# Altium schematic sheet USB.SchDoc
size B
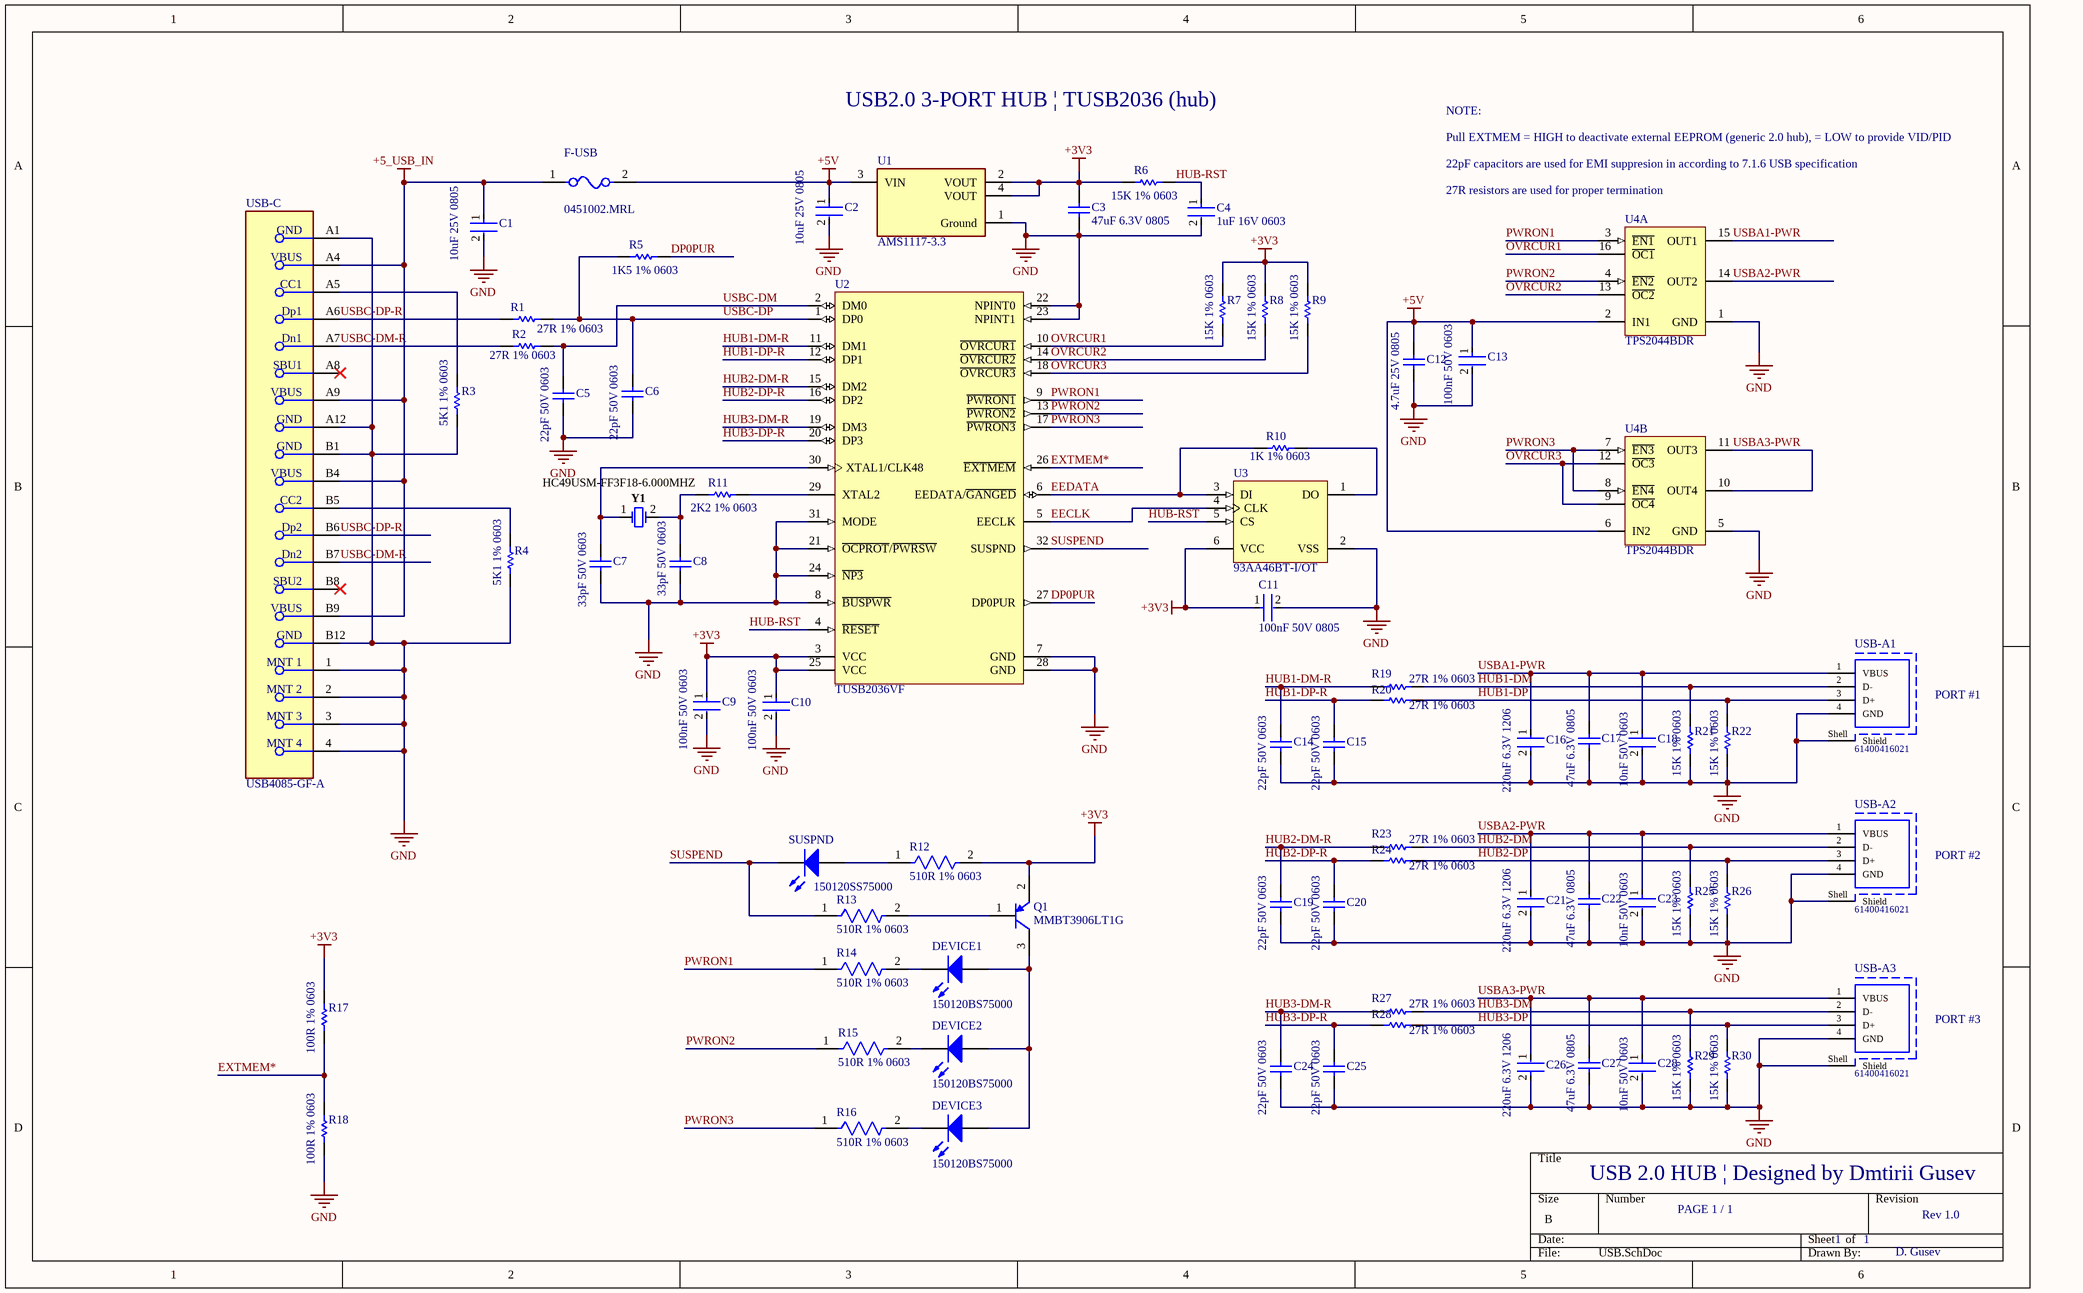
[diagram p0: USB.SchDoc]

## Parts
C1  10uF 25V 0805  [FP-GRM21B-0_15-IPC_C]
C2  10uF 25V 0805  [FP-GRM21B-0_15-IPC_C]
C3  47uF 6.3V 0805  [CAPC2013X145X50LL20T25]
C4  1uF 16V 0603  [FP-CC0603-DA-MFG]
C5  22pF 50V 0603  [CAPC1608X90X35ML10T15]
C6  22pF 50V 0603  [CAPC1608X90X35ML10T15]
C7  33pF 50V 0603  [CAPC1608X90X40LL10T20]
C8  33pF 50V 0603  [CAPC1608X90X40LL10T20]
C9  100nF 50V 0603  [FP-CGA3E-0_3-0_1-IPC_A]
C10  100nF 50V 0603  [FP-CGA3E-0_3-0_1-IPC_A]
C11  100nF 50V 0805  [FP-C0805C-DN-MFG]
C12  4.7uF 25V 0805  [CAPC2013X135X45ML10T25]
C13  100nF 50V 0603  [FP-CGA3E-0_3-0_1-IPC_A]
C14  22pF 50V 0603  [CAPC1608X90X35ML10T15]
C15  22pF 50V 0603  [CAPC1608X90X35ML10T15]
C16  220uF 6.3V 1206  [FP-GRM31C-0_3-e0_3_0_9-IPC_C]
C17  47uF 6.3V 0805  [CAPC2013X145X50LL20T25]
C18  10nF 50V 0603  [FP-CC0603-DA-MFG]
C19  22pF 50V 0603  [CAPC1608X90X35ML10T15]
C20  22pF 50V 0603  [CAPC1608X90X35ML10T15]
C21  220uF 6.3V 1206  [FP-GRM31C-0_3-e0_3_0_9-IPC_C]
C22  47uF 6.3V 0805  [CAPC2013X145X50LL20T25]
C23  10nF 50V 0603  [FP-CC0603-DA-MFG]
C24  22pF 50V 0603  [CAPC1608X90X35ML10T15]
C25  22pF 50V 0603  [CAPC1608X90X35ML10T15]
C26  220uF 6.3V 1206  [FP-GRM31C-0_3-e0_3_0_9-IPC_C]
C27  47uF 6.3V 0805  [CAPC2013X145X50LL20T25]
C28  10nF 50V 0603  [FP-CC0603-DA-MFG]
DEVICE1  150120BS75000  [1206_A]
DEVICE2  150120BS75000  [1206_A]
DEVICE3  150120BS75000  [1206_A]
F-USB  0451002.MRL  [FP-0451-MFG]
Q1  MMBT3906LT1G  [ONSC-SOT-23-3-318-08_V]
R1  27R 1% 0603  [RESC1608X55X30NL15T15]
R2  27R 1% 0603  [RESC1608X55X30NL15T15]
R3  5K1 1% 0603  [RESC1608X55X25ML10T15]
R4  5K1 1% 0603  [RESC1608X55X25ML10T15]
R5  1K5 1% 0603  [RESC1608X55X25ML10T15]
R6  15K 1% 0603  [RESC1608X55X25ML10T15]
R7  15K 1% 0603  [RESC1608X55X25ML10T15]
R8  15K 1% 0603  [RESC1608X55X25ML10T15]
R9  15K 1% 0603  [RESC1608X55X25ML10T15]
R10  1K 1% 0603  [RESC1608X55X25NL10T15]
R11  2K2 1% 0603  [RESC1608X55X25LL10T15]
R12  510R 1% 0603  [FP-AC0603-MFG]
R13  510R 1% 0603  [FP-AC0603-MFG]
R14  510R 1% 0603  [FP-AC0603-MFG]
R15  510R 1% 0603  [FP-AC0603-MFG]
R16  510R 1% 0603  [FP-AC0603-MFG]
R17  100R 1% 0603  [RESC1608X55X25ML10T15]
R18  100R 1% 0603  [RESC1608X55X25ML10T15]
R19  27R 1% 0603  [RESC1608X55X30NL15T15]
R20  27R 1% 0603  [RESC1608X55X30NL15T15]
R21  15K 1% 0603  [RESC1608X55X25ML10T15]
R22  15K 1% 0603  [RESC1608X55X25ML10T15]
R23  27R 1% 0603  [RESC1608X55X30NL15T15]
R24  27R 1% 0603  [RESC1608X55X30NL15T15]
R25  15K 1% 0603  [RESC1608X55X25ML10T15]
R26  15K 1% 0603  [RESC1608X55X25ML10T15]
R27  27R 1% 0603  [RESC1608X55X30NL15T15]
R28  27R 1% 0603  [RESC1608X55X30NL15T15]
R29  15K 1% 0603  [RESC1608X55X25ML10T15]
R30  15K 1% 0603  [RESC1608X55X25ML10T15]
SUSPND  150120SS75000  [1206_A]
U1  AMS1117-3.3  [FP-AMS1117-IPC_C]
U2  TUSB2036VF  [VF0032A_N]
U3  93AA46BT-I/OT  [SOT-23-OT6_N]
U4  TPS2044BDR  [D0016A_M]  (parts A,B of 2)
USB-A1  61400416021  [61400416021]
USB-A2  61400416021  [61400416021]
USB-A3  61400416021  [61400416021]
USB-C  USB4085-GF-A  [FP-USB4085-GF-A-MFG]
Y1  HC49USM-FF3F18-6.000MHZ  [ABRA-ABLS-14.7456MHZ-B2-T_V]

## Nets
+3V3: C3.2 C9.1 C10.1 C11.1 Q1.2(E) R6.1 R7.2 R8.2 R9.2 R12.2 R17.2 U1.2(VOUT) U1.4(VOUT) U2.3(VCC) U2.25(VCC) U3.6(VCC)
+5_USB_IN: C1.1 F-USB.1 USB-C.A4(VBUS) USB-C.A9(VBUS) USB-C.B4(VBUS) USB-C.B9(VBUS)
+5V: C2.1 C12.2 C13.1 F-USB.2 U1.3(VIN) U4.2(IN1) U4.6(IN2)
GND: C1.2 C2.2 C3.1 C4.2 C5.1 C6.1 C7.1 C8.1 C9.2 C10.2 C11.2 C12.1 C13.2 C14.1 C15.1 C16.2 C17.1 C18.2 C19.1 C20.1 C21.2 C22.1 C23.2 C24.1 C25.1 C26.2 C27.1 C28.2 R3.1 R4.1 R18.1 R21.1 R22.1 R25.1 R26.1 R29.1 R30.1 U1.1(Ground) U2.7(GND) U2.8(~{BUSPWR}) U2.21(~{OCPROT}/~{PWRSW}) U2.22(NPINT0) U2.23(NPINT1) U2.24(~{NP3}) U2.28(GND) U2.31(MODE) U3.2(VSS) U4.1(GND) U4.5(GND) USB-A1.4(GND) USB-A1.Shell(Shield) USB-A2.4(GND) USB-A2.Shell(Shield) USB-A3.4(GND) USB-A3.Shell(Shield) USB-C.1(MNT_1) USB-C.2(MNT_2) USB-C.3(MNT_3) USB-C.4(MNT_4) USB-C.A1(GND) USB-C.A12(GND) USB-C.B1(GND) USB-C.B12(GND)
DP0PUR: R5.2 U2.27(DP0PUR)
EECLK: U2.5(EECLK) U3.4(CLK)
EEDATA: R10.1 U2.6(EEDATA/~{GANGED}) U3.3(DI)
EXTMEM*: R17.1 R18.2 U2.26(~{EXTMEM})
HUB1-DM: R19.2 R21.2 USB-A1.2(D-)
HUB1-DM-R: C14.2 R19.1 U2.11(DM1)
HUB1-DP: R20.2 R22.2 USB-A1.3(D+)
HUB1-DP-R: C15.2 R20.1 U2.12(DP1)
HUB2-DM: R23.2 R25.2 USB-A2.2(D-)
HUB2-DM-R: C19.2 R23.1 U2.15(DM2)
HUB2-DP: R24.2 R26.2 USB-A2.3(D+)
HUB2-DP-R: C20.2 R24.1 U2.16(DP2)
HUB3-DM: R27.2 R29.2 USB-A3.2(D-)
HUB3-DM-R: C24.2 R27.1 U2.19(DM3)
HUB3-DP: R28.2 R30.2 USB-A3.3(D+)
HUB3-DP-R: C25.2 R28.1 U2.20(DP3)
HUB-RST: C4.1 R6.2 U2.4(~{RESET}) U3.5(CS)
OVRCUR1: R7.1 U2.10(~{OVRCUR1}) U4.16(~{OC1})
OVRCUR2: R8.1 U2.14(~{OVRCUR2}) U4.13(~{OC2})
OVRCUR3: R9.1 U2.18(~{OVRCUR3}) U4.9(~{OC4}) U4.12(~{OC3})
PWRON1: R14.1 U2.9(~{PWRON1}) U4.3(~{EN1})
PWRON2: R15.1 U2.13(~{PWRON2}) U4.4(~{EN2})
PWRON3: R16.1 U2.17(~{PWRON3}) U4.7(~{EN3}) U4.8(~{EN4})
SUSPEND: R13.1 SUSPND.1(K) U2.32(SUSPND)
USBA1-PWR: C16.1 C17.2 C18.1 U4.15(OUT1) USB-A1.1(VBUS)
USBA2-PWR: C21.1 C22.2 C23.1 U4.14(OUT2) USB-A2.1(VBUS)
USBA3-PWR: C26.1 C27.2 C28.1 U4.10(OUT4) U4.11(OUT3) USB-A3.1(VBUS)
USBC-DM: C5.2 R2.2 U2.2(DM0)
USBC-DM-R: R2.1 USB-C.A7(Dn1) USB-C.B7(Dn2)
USBC-DP: C6.2 R1.2 R5.1 U2.1(DP0)
USBC-DP-R: R1.1 USB-C.A6(Dp1) USB-C.B6(Dp2)
NetC7_2: C7.2 U2.30(XTAL1/CLK48) Y1.1
NetC8_2: C8.2 R11.1 Y1.2
NetDEVICE1_1: DEVICE1.1(K) R14.2
NetDEVICE1_2: DEVICE1.2(A) DEVICE2.2(A) DEVICE3.2(A) Q1.3(C)
NetDEVICE2_1: DEVICE2.1(K) R15.2
NetDEVICE3_1: DEVICE3.1(K) R16.2
NetQ1_1: Q1.1(B) R13.2
NetR3_2: R3.2 USB-C.A5(CC1)
NetR4_2: R4.2 USB-C.B5(CC2)
NetR10_2: R10.2 U3.1(DO)
NetR11_2: R11.2 U2.29(XTAL2)
NetR12_1: R12.1 SUSPND.2(A)

Not connected (* = marked no-connect by the designer): USB-C A8(SBU1)* B8(SBU2)*

## Notes on the sheet
- USB2.0 3-PORT HUB | TUSB2036 (hub)
- NOTE:
- Pull EXTMEM = HIGH to deactivate external EEPROM (generic 2.0 hub), = LOW to provide VID/PID
- 22pF capacitors are used for EMI suppresion in according to 7.1.6 USB specification
- (near U4) 27R resistors are used for proper termination
- PORT #1
- PORT #2
- PORT #3
- USB 2.0 HUB | Designed by Dmtirii Gusev
- PAGE 1 / 1
- 1
- Rev 1.0
- D. Gusev

## Library data of the parts
C1 C2 = CMP-2007-03541-2: Chip Multilayer Ceramic Capacitors for General Purpose, 0805, 10uF, X5R, 15%, 10%, 25V; Length: 2mm; Depth: 1.25mm; Termination: SMD/SMT; Voltage: 25V; Height: 1.25mm; Material: Ceramic; Thickness: 0.053inch; Radiation Hardening: No; Min Operating Temperature: -55°C; Width: 0.049inch; Package Quantity: 1; Mount: Surface Mount; Dielectric: X5R; Packaging: Tape and Reel; Capacitance: 10uF; Voltage Rating (DC): 25V; Lead Free: Lead Free; Max Operating Temperature: 85°C; Case Code (Imperial): 0805; Case/Package: 0805; Tolerance: 10%; Voltage Rating: 25V; Case Code (Metric): 2012
C3 C17 C22 C27 = CMP-2007-01008-1: Manufacturer: Kemet; Part Number: C0805C476M9PACTU
C4 = CMP-03422-000924-1: CAP CER 1UF 16V X7R 0603; Manufacturer: YAGEO; Manufacturer Part Number: CC0603KRX7R7BB105; Tolerance: 0.1; Temperature Coefficient: 15%; Material: Ceramic; Package: CC0603-DA; RoHS: TRUE; Device Class L2: Capacitors; Temperature Characteristic: X7R; Temperature: -55°C to +125°C; Temperature Range Low: -55°C; Automotive: No; ComponentLink2Description: Datasheet; Value: 1 uF; Lead Free: Yes; Capacitance: 1 uF; ComponentLink2URL: http://www.yageo.com/documents/recent/UPY-GPHC_X7R_6.3V-to-50V_18.pdf; Device Class L1: Passive Components; Voltage: 16 V; Octopart: https://octopart.com/cc0603krx7r7bb105-yageo-42271928; Category: Cap; Digikey Description: CAP CER 1UF 16V X7R 0603; Footprint Url: http://www.yageo.com/exep/pages/download/literatures/UPY-C_GEN_24.pdf; Height: 0.9mm; Voltage Rating: 16 V; Temperature Range High: +125°C; Mouser Description: Multilayer Ceramic Capacitor, CC Series, 1 - F, - 10%, X7R, 16 V, 0603 [1608 Metric]; Device Class L3: Ceramic Capacitors
C5 C6 C14 C15 C19 C20 C24 C25 = CMP-2000-04945-1: Chip Capacitor, 22 pF, +/- 5%, 50 V, -55 to 125 degC, 0603 (1608 Metric), RoHS, Tape and Reel; Manufacturer: Murata; Dielectric: C0G; Capacitance: 22pF; Manufacturer URL: http://www.murata.com/; Datasheet Version: Jul-06; Package Reference: 603; Tolerance (%): ±5%; Case Size/Dimension: 0603; Rated Voltage: 50V; Package Description: 2-Pin Surface Mount Device, Body 1.6 x 0.8 mm; Datasheet URL: https://datasheet.ciiva.com/11786/0900766b807a1cab-11786398.pdf
C7 C8 = CMP-2000-06072-1: Chip Capacitor, 33 pF, +/- 5%, 50 V, -55 to 125 degC, 0603 (1608 Metric), RoHS, Tape and Reel; Manufacturer: Yageo; Product Training Modules: MultilayerCeramicCapacitors; Featured Product: CommodityMultilayerCeramicCapacitors–CCSeries; Other Names: 0603CG330J9B200223886715339223886715339311-1064-2311-1282-2311-1282-2-NDCC0603JRNP09BN330BCC0603JRNPO9BN330B; Online Catalog: CCSeries; Temperature Coefficient: C0G,NP0; Operating Temperature: -55°C~125°C; Thickness (Max): 0.035"(0.90mm); Size / Dimension: 0.063"Lx0.031"W(1.60mmx0.80mm); Lead Spacing: -; Mounting Type: SurfaceMount,MLCC; Voltage - Rated: 50V; Tolerance: ±5%; Standard Package: 4,000; Mounting Technology: SurfaceMount; Ratings: -; Capacitance: 33pF; Applications: GeneralPurpose; Height - Seated (Max): -; Packaging: Tape&Reel(TR); Series: CC; Package / Case: 0603(1608Metric); Package Description: 2-Pin Surface Mount Device, Body 1.6 x 0.8 mm; Manufacturer URL: http://www.yageo.com/; Family: CeramicCapacitors; Package Reference: 0603; Category: Capacitors; Datasheet Version: Rev. 14, 07/2016; Datasheet URL: http://www.yageo.com/NewPortal/yageodocoutput?fileName=/pdf/MLCC/UPY-GP_NP0_16V-to-50V_14.pdf; Features: -; Lead Style: -
C9 C10 C13 = CMP-2000-07546-2: Cap Ceramic 100nF 50V X7R 10% Pad SMD 0603 +125°C Automotive T/R; Weight: 7.1E-05oz; Composition: Ceramic; Max Operating Temperature: 125°C; Termination: SMD/SMT; Dielectric: X7R; Length: 1.6mm; Package Quantity: 1; REACH SVHC: No SVHC; Lead Free: Lead Free; Case Code (Metric): 1608; Min Operating Temperature: -55°C; Packaging: Tape and Reel; Tolerance: 10%; Voltage Rating: 50V; Case Code (Imperial): 0603; Capacitance: 100nF; Case/Package: 0603; Voltage Rating (DC): 50V; Depth: 0.8mm; Radiation Hardening: No; Ratings: AEC-Q200; Mount: Surface Mount; Voltage: 50V; Thickness: 0.035inch; Width: 0.8mm; Height: 0.8mm
C11 = CMP-2007-00279-2: CAP CER 0.1UF 50V X7R 0805; Manufacturer Part Number: C0805C104K5RACTU; Manufacturer: KEMET; Value: 0.10 μF; Tolerance: 0.1; Temperature Coefficient: 30ppm/°C; Material: Ceramic; Device Class L2: Capacitors; Temperature Range Low: -55°C; Voltage Rating: 50 V; Digikey Description: CAP CER 0.1UF 50V X7R 0805; Category: Cap; ComponentLink2Description: Datasheet; Octopart: https://octopart.com/c0805c104k5ractu-kemet-143926; RoHS: TRUE; ComponentLink2URL: https://content.kemet.com/datasheets/KEM_C1003_C0G_SMD.pdf; Temperature Characteristic: X7R; Temperature: -55°C to +125°C; Height: 0.88mm; Temperature Range High: +125°C; Device Class L1: Passive Components; Automotive: No; Lead Free: Yes; Ipc Land Pattern Name: CAPC200125X78; Device Class L3: Ceramic Capacitors; Mouser Description: Cap Ceramic 0.1uF 50V X7R 10% SMD 2.0 x 1.2 mm 125 C Paper T/R; Capacitance: 0.10 μF; Package: C0805C-DN
C12 = CMP-2007-03546-1: Manufacturer: Murata; Part Number: GRM21BR61E475MA12L
C16 C21 C26 = CMP-06035-000079-2: Chip Multilayer Ceramic Capacitors for General Purpose, 1206, 220uF, X5R, 15%, 20%, 6.3V; Mount: Surface Mount; Width: 0.063inch; Voltage Rating: 6.3V; Packaging: Cut Tape; Dielectric: X5R; Capacitance: 220uF; Voltage Rating (DC): 6.3V; Case/Package: 1206; Thickness: 0.075inch; Tolerance: 20%; Max Operating Temperature: 85°C; Case Code (Metric): 3216; Min Operating Temperature: -55°C; Length: 0.126inch; REACH SVHC: No SVHC; Case Code (Imperial): 1206
C18 C23 C28 = CMP-2100-03600-2: CAP CER 10000PF 50V X7R 0603; Manufacturer Part Number: CC0603KRX7R9BB103; Manufacturer: YAGEO; Tolerance: 0.1; Material: Ceramic; Temperature Coefficient: 15%; Mouser Description: Multilayer Ceramic Capacitor, CC Series, 0.01 - F, - 10%, X7R, 50 V, 0603 [1608 Metric]; Digikey Description: CAP CER 10000PF 50V X7R 0603; Height: 0.9mm; Category: Cap; Temperature Characteristic: X7R; Footprint Url: http://www.yageo.com/exep/pages/download/literatures/UPY-C_GEN_24.pdf; Lead Free: Yes; Voltage Rating: 50 V; Temperature: -55°C to +125°C; Device Class L3: Ceramic Capacitors; ComponentLink2Description: Datasheet; Voltage: 50 V; Package: CC0603-DA; Octopart: https://octopart.com/cc0603krx7r9bb103-yageo-192938; Automotive: No; Temperature Range High: +125°C; Temperature Range Low: -55°C; Value: 10 nF; RoHS: TRUE; Device Class L1: Passive Components; ComponentLink2URL: http://www.yageo.com/documents/recent/UPY-GPHC_X7R_6.3V-to-50V_18.pdf; Device Class L2: Capacitors; Capacitance: 10 nF
DEVICE1-DEVICE3 = CMP-1426-00015-1: SMD mono-color Chip LED, WL-SMCW, Blue; Manufacturer: Wuerth Elektronik; ComponentLink2Description: Datasheet; ComponentLink1URL: http://www.we-online.com; PartNumber: 150120BS75000; ComponentLink1Description: Manufacturer URL; ComponentLink2URL: http://katalog.we-online.com/led/datasheet/150120BS75000.pdf; PackageReference: 1206_A; Color: Blue
F-USB = CMP-08605-000053-1: FUSE BOARD MNT 2A 125VAC/VDC SMD; Manufacturer: Littelfuse; Max Fuse Dc Voltage: 125V; Value: 0.0367Ω; Fuse Interrupt Ac Current: 50A; Fuse I2T: 0.53A2Sec; Fuse Blow Speed: Fast; Device Class L2: Fuses; Temperature Range High: +125°C; Category: Fuse; ComponentLink2URL: https://www.littelfuse.com/~/media/electronics/datasheets/fuses/littelfuse_fuse_451_453_datasheet.pdf.pdf; Automotive: No; Temperature Range Low: -55°C; Voltage Rating: 125V; ComponentLink2Description: Datasheet; Temperature: -55°C to +125°C; Device Class L3: unset; Height: 2.94mm; Lead Free: Yes; Resistance: 0.0367Ω; Max Fuse Ac Voltage: 125V; Fuse Interrupt Dc Current: 50A; RoHS: TRUE; Fuse Current: 2A; Digikey Description: FUSE BOARD MNT 2A 125VAC/VDC SMD; Device Class L1: Circuit Protection; Octopart: https://octopart.com/0451002.mrl-littelfuse-566376; Mouser Description: Surface Mount Fuses 125V 2A; Package: 0451; Manufacturer Part Number: 0451002.MRL
Q1 = CMP-1048-00670-1: General Purpose Transistor, PNP Silicon, 3-Pin SOT-23, Pb-Free, Tape and Reel; Manufacturer: On Semiconductor; IC Continuous (A): -0.2; fT Min (MHz): 250; PackageDescription: 3-Pin Small Outline Transistor, Body 2.92 x 1.3 mm, Pitch 0.95 mm; PartNumber: MMBT3906LT1G; Packing: Tape and Reel; ComponentLink3Description: Package Specification; Mounting Technology: Surface Mount; ComponentLink3URL: http://www.onsemi.cn/pub_link/Collateral/318-08.PDF; ComponentLink1URL: http://www.onsemi.com/; ComponentLink2URL: http://www.onsemi.cn/pub_link/Collateral/MMBT3906LT1-D.PDF; PackageReference: SOT-23-3-318-08; Polarity: PNP; ComponentLink2Description: Datasheet; PackageVersion: Rev. AP, 11/2009; RoHS: TRUE; DatasheetVersion: Rev. 11; ComponentLink1Description: Manufacturer URL
R1 R2 R19 R20 R23 R24 R27 R28 = CMP-2000-00396-1: Manufacturer: Panasonic; Part Number: ERJ3EKF27R0V
R3 R4 = CMP-2000-04091-1: Manufacturer: Yageo; Part Number: RC0603FR-075K1L
R5 = CMP-2100-03665-1: Chip Resistor, 1.5 KOhm, +/- 1%, 0.1 W, -55 to 155 degC, 0603 (1608 Metric), RoHS, Tape and Reel; Manufacturer: Yageo; Power Rating: 100mW; Voltage Rating: 50V; Temperature Coefficient: 100ppm/degreesC; Military Standard: Not; Datasheet URL: http://www.yageo.com/NewPortal/yageodocoutput?fileName=/pdf/R-Chip/PYu-RC_Group_51_RoHS_L_5.pdf; Package Description: 2-Pin Surface Mount Device, Body 1.6 x 0.8 mm; Composition: ThickFilm; Case Code (Metric): 1608; Case/Package: 0603; Number of Terminations: 2; Depth: 0.8mm; Height: 0.022inch; Manufacturer URL: http://www.yageo.com/; Lead Free: LeadFree; Min Operating Temperature: -55degC; Max Operating Temperature: 155degC; Datasheet Version: Rev. 5, 10/2016; RoHSCompliant: true; Max Power Dissipation: 100mW; Packaging: TapeandReel; Voltage Rating (DC): 50V; Length: 0.063inch; Tolerance: 1%; Width: 0.031inch; Number of Pins: 2; Termination: SMD/SMT; Package Reference: 0603; Package Quantity: 1; Case Code (Imperial): 0603; Resistance: 1.5KOhm; REACH SVHC: NoSVHC
R6-R9 R21 R22 R25 R26 R29 R30 = CMP-1659-00032-1: Chip Resistor, 15 KOhm, +/- 1%, 0.1 W, -55 to 155 degC, 0603 (1608 Metric), RoHS, Tape and Reel; PackageDescription: 2-Pin Surface Mount Device, Body 1.6 x 0.8 mm; RoHSCompliant: true; ComponentLink2Description: Datasheet; DatasheetVersion: Rev. 4, 02/2016; ComponentLink1Description: Manufacturer URL; ComponentLink1URL: http://www.yageo.com/; PackageReference: 0603; ComponentLink2URL: http://www.yageo.com/documents/recent/PYu-RC_Group_51_RoHS_L_04.pdf
R10 = CMP-1659-00009-4: Chip Resistor, 1 KOhm, +/-1%, 0.1 W, -55 to 155 degC, 0603 (1608 Metric), RoHS, Tape and Reel; Manufacturer: Yageo; Voltage Rating: 50 V; ComponentLink2URL: http://www.yageo.com/documents/recent/PYu-RC_Group_51_RoHS_L_04.pdf; Max Operating Temperature: 155 degC; PackageDescription: 2-Pin Surface Mount Device, Body 1.6 x 0.8 mm; Packaging: Tape and Reel; ComponentLink3Description: Package Specification; REACH SVHC: No SVHC; Mount: Surface Mount; ComponentLink2Description: Datasheet; Length: 1.6 mm; PackageReference: 0603; Height: 0.45 mm; DatasheetVersion: Rev. 4, 02/2016; Min Operating Temperature: -55 degC; ComponentLink1Description: Manufacturer URL; Package Quantity: 200; RoHSCompliant: true; ComponentLink3URL: http://www.farnell.com/datasheets/443971.pdf; Pins: 2; Mounting Technology: Surface Mount; ComponentLink1URL: http://www.yageo.com/
R11 = CMP-2000-06934-1: Thick Film Resistor, 2.2 KOhm, 100 mW, 50 V, +/- 1%, -55 to 155 degC, 2-Pin SMD (0603), RoHS, Tape and Reel; Manufacturer: Yageo; Resistance: 2.2kOhms; Temperature Coefficient: 100PPM/C; Voltage Rating: 50V; Power Rating: 100mW; Tolerance: 1%; Datasheet Version: Rev. 7, 05/2017; Case Code - mm: 1608; Series: RC; Mounting Technology: SurfaceMount; Package Description: 2-Pin Surface Mount Device, Body 1.6 x 0.8 mm; Case Code - in: 0603; Package Reference: 0603; Product: ThickFilmResistorsGeneralPurpose; Manufacturer URL: http://www.yageo.com/; Termination Style: SMD/SMT; Operating Temperature Range: -55Cto+155C; Datasheet URL: http://www.yageo.com/documents/recent/PYu-RC_Group_51_RoHS_L_7.pdf; Packaging: Reel
R12-R16 = CMP-03412-001484-1: RES SMD 510 OHM 1% 1/10W 0603; Manufacturer: Yageo; Manufacturer Part Number: AC0603FR-07510RL; Value: 510Ω; Automotive Grade: Grade 0; Power Rating: 0.1W; Tolerance: 0.01; Voltage Rating: 75V; ComponentLink2URL: http://www.yageo.com/NewPortal/yageodocoutput?fileName=/pdf/R-Chip/PYu-AC_51_RoHS_L_6.pdf; Octopart: https://octopart.com/ac0603fr-07510rl-yageo-33978667; RoHS: TRUE; Composition: Thick Film; Lead Free: Yes; Height: 0.55mm; Digikey Description: RES SMD 510 OHM 1% 1/10W 0603; ComponentLink2Description: Datasheet; Temperature: -55°C to +155°C; Footprint Url: http://www.yageo.com/exep/pages/download/literatures/PYu-R_Mount_9.pdf; Device Class L3: Chip SMD Resistors; Series: AC; Ipc Land Pattern Name: RESC16080X45; Package: AC0603; Temperature Range High: +155°C; Resistance: 510Ω; Automotive: Yes; Device Class L2: Resistors; Category: Res; Device Class L1: Passive Components; Temperature Range Low: -55°C
R17 R18 = CMP-2100-03663-1: Chip Resistor, 100 Ohm, +/- 1%, 0.1 W, -55 to 155 degC, 0603 (1608 Metric), RoHS, Tape and Reel; Manufacturer: Yageo; Voltage Rating (DC): 50V; Power Rating: 100mW; Resistance: 100Ohm; Temperature Coefficient: 100ppm/degreesC; Number of Pins: 2; Tolerance: 1%; Height: 0.45mm; Manufacturer URL: http://www.yageo.com/; Military Standard: Not; Datasheet URL: http://www.yageo.com/NewPortal/yageodocoutput?fileName=/pdf/R-Chip/PYu-RC_Group_51_RoHS_L_5.pdf; Case Code (Imperial): 0603; Termination: SMD/SMT; Lead Free: LeadFree; Max Operating Temperature: 155degC; Case Code (Metric): 1608; RoHSCompliant: true; Voltage Rating: 50V; Width: 0.8mm; Composition: ThickFilm; Depth: 0.8mm; REACH SVHC: Unknown; Min Operating Temperature: -55degC; Packaging: TapeandReel; Package Description: 2-Pin Surface Mount Device, Body 1.6 x 0.8 mm; Length: 1.6mm; Package Reference: 0603; Datasheet Version: Rev. 5, 10/2016; Case/Package: 0603
SUSPND = CMP-1426-00017-1: SMD mono-color Chip LED, WL-SMCW, Super Red; Manufacturer: Wuerth Elektronik; ComponentLink1URL: http://www.we-online.com; PackageReference: 1206_A; ComponentLink2Description: Datasheet; ComponentLink1Description: Manufacturer URL; ComponentLink2URL: http://katalog.we-online.com/led/datasheet/150120SS75000.pdf; Color: Super Red; PartNumber: 150120SS75000
U1 = CMP-209535-000001-1: LDO Voltage Regulators 1A, 3.3V; Manufacturer: Advanced Monolithic Systems; Dropout Voltage: 1.1V; Output Type: Fixed; Nominal Supply Current: 5mA; Max Power Dissipation: 1.2W; Max Supply Voltage: 15V; Number Of Outputs: 1; Standoff Height: 0.64mm; Max Junction Temp: +125°C; Height: 1.8mm; Package: AMS1117; Device Class L2: Power Management ICs; ComponentLink2Description: Datasheet; ComponentLink2URL: http://www.advanced-monolithic.com/pdf/ds1117.pdf; Category: IC; RoHS: TRUE; Automotive: No; Device Class L1: Integrated Circuits (ICs); Output Current: 1A; Device Class L3: Voltage Regulators - Linear; Temperature: -40°C to +125°C; Output Voltage: 3.3V; Manufacturer Part Number: AMS1117-3.3; Temperature Range Low: -40°C; Octopart: https://octopart.com/ams1117-3.3-advanced+monolithic+systems-25899300; Lead Free: Yes; Ipc Land Pattern Name: SOT229P700X180-4; Temperature Range High: +125°C
U2 = CMP-0309-00077-2: 2 / 3-Port Hub for USB with Optional Serial EEPROM Interface, 3.3V, 0 to 70 degC, 32-Pin LQFP (VF), Green (RoHS & no Sb/Br); Manufacturer: Texas Instruments; USB Speed: Full; Supply Voltage(s)(V): 3.3; SubFamily: USB Hub Controller; USB Full Speed: True; ComponentLink2Description: Package Specification; Eco-Plan: Green (RoHS & no Sb/Br); ComponentLink1Description: Datasheet; ComponentLink2URL: http://www.ti.com/litv/pdf/mtqf002b; PackageVersion: revD, Apr-2000; PartNumber: TUSB2036VF; PackageReference: VF0032A; ComponentLink1URL: http://www.ti.com/general/docs/lit/getliterature.tsp?genericPartNumber=TUSB2036&fileType=pdf; Mounting Technology: Surface Mount; Integrated MCU Architecture: N/A; PackageDescription: 32-Pin Plastic Quad Flatpack, 7 x 7 mm Body, 0.8 mm Pitch; DatasheetVersion: SLLS372E
U3 = CMP-0162-00322-1: 1K, 64x16-bit, 1.8V Microwire Serial EEPROM, 6-Pin SOT-23, Industrial Temperature, Tape and Reel; DatasheetVersion: revG, May-2008; PackageVersion: revBB, Aug-2009; Code_IPC: SOT26A-6; PackageDescription: 6-Lead Plastic Small Outline Transistor (OT) [SOT-23]; PackageReference: SOT-23-OT6
U4 = CMP-0337-00039-2: Quad Current-Limited Power Distribution Switch, 1 A Current Limit, -40 to 85 degC, 16-pin SOIC (D), Green (RoHS & no Sb/Br); Manufacturer: Texas Instruments; Continuous Current(Max)(A): 0.5; Vin(Max)(V): 5.5; NEMKO: TRUE; rDS(on) per FET(Typ)(mOhms): 70; Rating: Catalog; Current Limit(A): 1; Enable: Active Low; Number of Switches: 4; Vin(Min)(V): 2.7; Mounting Technology: Surface Mount; Eco-Plan: Green (RoHS & no Sb/Br); Code_JEDEC: MS-012AC; PackageVersion: revM, Jun-2011; PackageDescription: 16-Pin Plastic Small Outline Integrated Circuit, 9.9 x 3.9 mm, Pitch 1.27 mm Pitch; DatasheetVersion: SLVS514L; PartNumber: TPS2044BDR; ComponentLink1Description: Datasheet; UL Listed: TRUE; ComponentLink1URL: http://www.ti.com/general/docs/lit/getliterature.tsp?genericPartNumber=TPS2044B&fileType=pdf; PackageReference: D0016A
USB-A1-USB-A3 = CMP-1502-03227-1: USB 2.0 Type A Receptacle WR-COM, Horizontal, THT; Manufacturer: Wurth Elektronik; Working Voltage: 30VAC; Rated Current: 1.5A; Contact Resistance: 20mOhm; Manufacturer URL: http://www.we-online.de; Publisher: WurthElektronik; Packaging: Tray; Operating Temperature: -40to105degC; Orientation: Horizontal; Mounting Technology: THT; Part Number: 61400416021; Gender: Receptacle; Package Reference: 61400416021; Connector Type: USB2.0TypeA; Datasheet URL: https://katalog.we-online.de/em/datasheet/61400416021.pdf
USB-C = CMP-196119-000001-1: CONN RCPT USB2.0 TYPEC 16POS; Manufacturer: Global Connector Technology; Voltage Rating: 20V; Conn Orientation: Right Angle; Shielding: true; Current Rating: 4.25A; Number Of Contacts: 16; Pitch: 0.85mm; Is Female: yes; ComponentLink2URL: https://gct.co/files/drawings/usb4085.pdf; Category: Conn; Automotive: No; ComponentLink2Description: Datasheet; Height: 3.66mm; Manufacturer Part Number: USB4085-GF-A; Package: 0; Usb Standard: USB 2.0; Octopart: https://octopart.com/usb4085-gf-a-global+connector+technology-94773699; Device Class L3: unset; Digikey Description: CONN RCPT USB2.0 TYPEC 16POS; Temperature Range Low: -40°C; Temperature: -40°C to +85°C; Lead Free: Yes; Contact Material: Gold,Nickel; Device Class L1: Connectors; Temperature Range High: +85°C; Device Class L2: USB Connectors; RoHS: TRUE
Y1 = CMP-2000-05725-1: Low Profile Crystal, 14.7456 MHz, 18 pF, -20 to 70 degC, 2-Pin SMD, RoHS, Tape and Reel; Manufacturer: ABRACON; ESR: 50Ohms; Case Width: 4.7mm; Case Length: 11.4mm; Frequency Stability: 50PPM; Tolerance: 20PPM; Case Height: 4.2mm; Load Capacitance: 18pF; Datasheet URL: http://www.abracon.com/Resonators/abls.pdf; Package / Case: HC-49/US; Dimensions: 4.7mmWx11.4mmLx4.2mmH; Mounting Technology: SurfaceMount; RoHS: Details; Series: ABLS; Frequency: 14.7456MHz; Datasheet Version: 04/2011; Mounting Style: SMD/SMT; Packaging: Reel; Factory Pack Quantity: 1000; Product Category: Crystals; Package Reference: ABLS-14.7456MHZ-B2-T; Package URL: http://www.abracon.com/Support/PackageDrawing/Resonators/ABLS-2D.pdf; Manufacturer URL: http://www.abracon.com/; Package Description: 2-Pin Surface Mount Device, Body 11.4 x 4.7 mm; Termination Style: SMD/SMT; Operating Temperature Range: -20Cto+70C; Type: LowProfileMicroprocessorCrystal; Brand: ABRACON